# Altium schematic sheet main.SchDoc
size A4
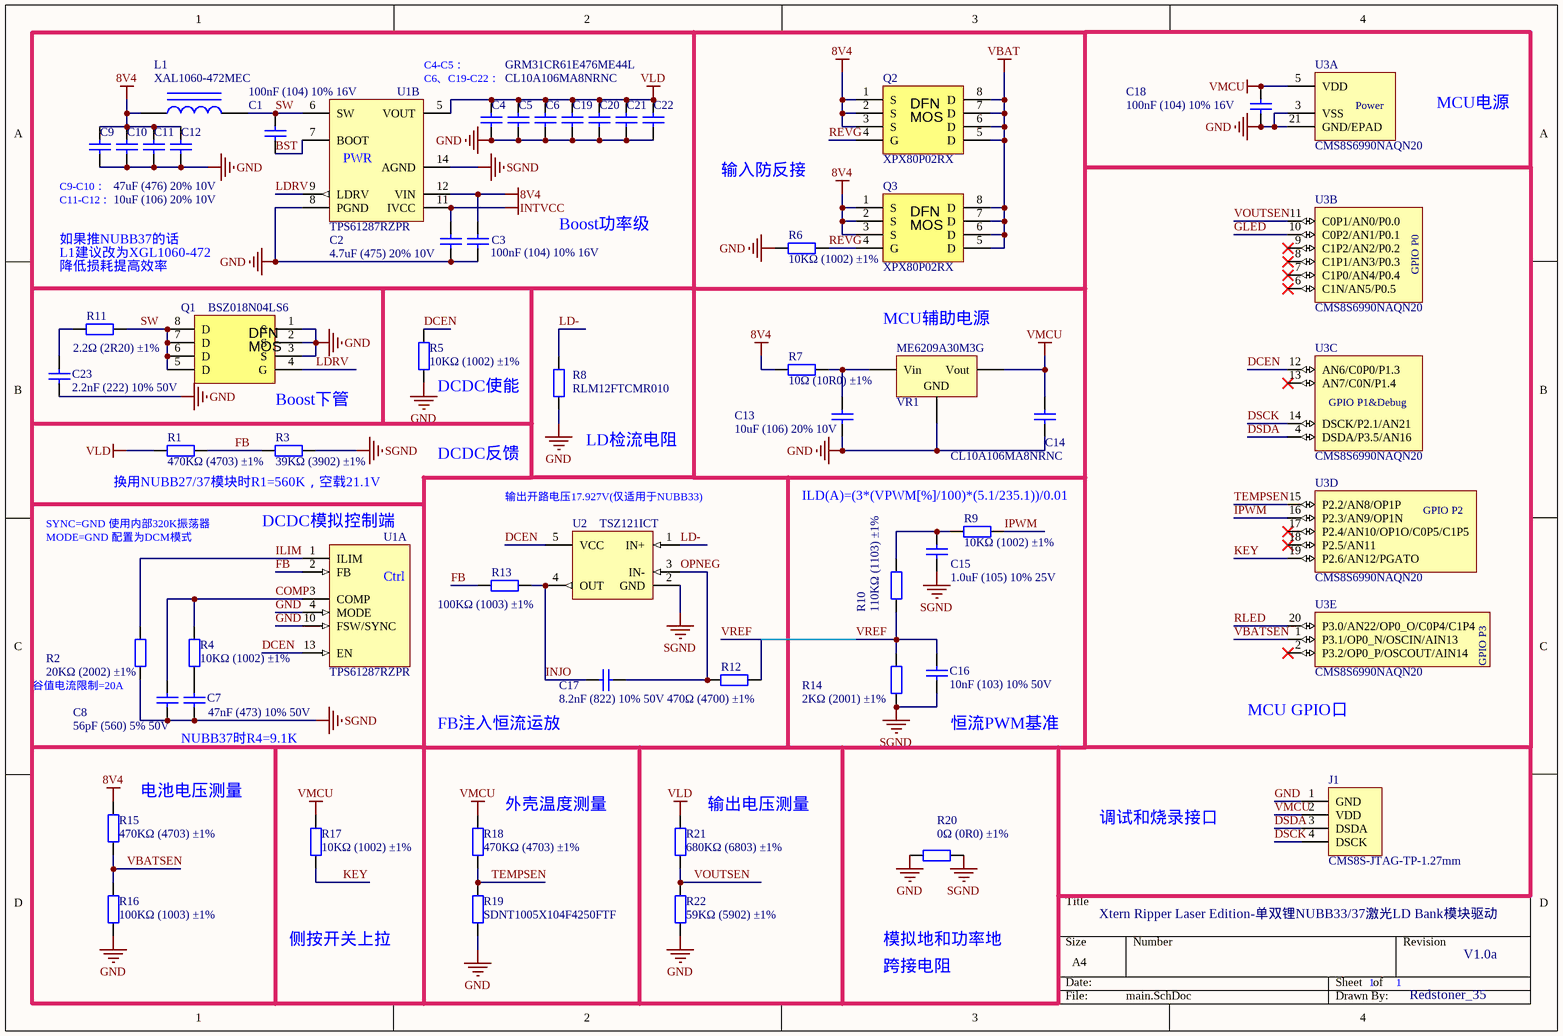
[diagram p0: main.SchDoc]

## Parts
C1  100nF (104) 10% 16V  [0402_C]
C2  4.7uF (475) 20% 10V  [0402_C]
C3  100nF (104) 10% 16V  [0402_C]
C4  GRM31CR61E476ME44L  [1206C]
C5  GRM31CR61E476ME44L  [1206C]  (value not drawn)
C6  CL10A106MA8NRNC  [0603_C]
C7  47nF (473) 10% 50V  [0402_C]
C8  56pF (560) 5% 50V  [0402_C]
C9  10uF (106) 20% 10V  [0402_C]
C10  10uF (106) 20% 10V  [0402_C]  (value not drawn)
C11  47uF (476) 20% 10V  [0805_C]
C12  47uF (226) 20% 10V  [0805_C]  (value not drawn)
C13  10uF (106) 20% 10V  [0402_C]
C14  CL10A106MA8NRNC  [0603_C]
C15  1.0uF (105) 10% 25V  [0402_C]
C16  10nF (103) 10% 50V  [0402_C]
C17  8.2nF (822) 10% 50V  [0402_C]
C18  100nF (104) 10% 16V  [0402_C]
C19  CL10A106MA8NRNC  [0603_C]  (value not drawn)
C20  CL10A106MA8NRNC  [0603_C]  (value not drawn)
C21  CL10A106MA8NRNC  [0603_C]  (value not drawn)
C22  CL10A106MA8NRNC  [0603_C]  (value not drawn)
C23  2.2nF (222) 10% 50V  [0402_C]
J1  CMS8S-JTAG-TP-1.27mm  [CMS8S-JTAG-TP-2x2-P1.27]
L1  XAL1060-472MEC  [XAL1060-472ME-Lifted]
Q1  BSZ018N04LS6  [DFN-8_L3.0-W3.0-P0.65-BL]
Q2  XPX80P02RX  [DFN-8_L3.0-W3.0-P0.65-BL]
Q3  XPX80P02RX  [DFN-8_L3.0-W3.0-P0.65-BL]
R1  470KΩ (4703) ±1%  [0402_R]
R2  20KΩ (2002) ±1%  [0402_R]
R3  39KΩ (3902) ±1%  [0402_R]
R4  10KΩ (1002) ±1%  [0402_R]
R5  10KΩ (1002) ±1%  [0402_R]
R6  10KΩ (1002) ±1%  [0402_R]
R7  10Ω (10R0) ±1%  [0402_R]
R8  RLM12FTCMR010  [1206_R]
R9  10KΩ (1002) ±1%  [0402_R]
R10  110KΩ (1103) ±1%  [0402_R]
R11  2.2Ω (2R20) ±1%  [0603_R]
R12  470Ω (4700) ±1%  [0402_R]
R13  100KΩ (1003) ±1%  [0402_R]
R14  2KΩ (2001) ±1%  [0402_R]
R15  470KΩ (4703) ±1%  [0402_R]
R16  100KΩ (1003) ±1%  [0402_R]
R17  10KΩ (1002) ±1%  [0402_R]
R18  470KΩ (4703) ±1%  [0402_R]
R19  SDNT1005X104F4250FTF  [0402_R]
R20  0Ω (0R0) ±1%  [0402_R]
R21  680KΩ (6803) ±1%  [0402_R]
R22  59KΩ (5902) ±1%  [0402_R]
U1  TPS61287RZPR  [RZP0014A-TPS61287]  (parts A,B of 2)
U2  TSZ121ICT  [SC70-5]
U3  CMS8S6990NAQN20  [QFN40P300X300X800_HS-21N]  (parts A,B,C,D,E of 5)
VR1  ME6209A30M3G  [SOT-23-3L]

## Nets
8V4: C3.2 C9.2 C10.2 C11.2 C12.2 L1.1 Q2.1(S) Q2.2(S) Q2.3(S) Q3.1(S) Q3.2(S) Q3.3(S) R7.1 R15.2 U1.12(VIN)
GND: C2.1 C3.1 C4.1 C5.1 C6.1 C9.1 C10.1 C11.1 C12.1 C13.1 C14.1 C18.1 C19.1 C20.1 C21.1 C22.1 C23.1 J1.1(GND) Q1.1(S) Q1.2(S) Q1.3(S) R5.1 R6.1 R8.1 R16.1 R19.1 R20.1 R22.1 U1.4(MODE) U1.8(PGND) U1.10(FSW/SYNC) U3.3(VSS) U3.21(GND/EPAD) VR1.1(GND)
INTVCC: C2.2 U1.11(IVCC)
SGND: C7.1 C8.1 C15.1 C16.1 R2.2 R3.1 R14.1 R20.2 U1.14(AGND) U2.2(GND)
VBAT: Q2.5(D) Q2.6(D) Q2.7(D) Q2.8(D) Q3.5(D) Q3.6(D) Q3.7(D) Q3.8(D)
VLD: C4.2 C5.2 C6.2 C19.2 C20.2 C21.2 C22.2 R1.1 R21.2 U1.5(VOUT)
VMCU: C14.2 C18.2 J1.2(VDD) R17.2 R18.2 U3.5(VDD) VR1.2(Vout)
BST: C1.1 U1.7(BOOT)
COMP: C8.2 R4.2 U1.3(COMP)
DCEN: R5.2 U1.13(EN) U2.5(VCC) U3.12(AN6/C0P0/P1.3)
DSCK: J1.4(DSCK) U3.14(DSCK/P2.1/AN21)
DSDA: J1.3(DSDA) U3.4(DSDA/P3.5/AN16)
FB: R1.2 R3.2 R13.1 U1.2(FB)
GLED: U3.10(C0P2/AN1/P0.1)
ILIM: R2.1 U1.1(ILIM)
INJO: C17.1 R13.2 U2.4(OUT)
IPWM: R9.1 U3.16(P2.3/AN9/OP1N)
KEY: R17.1 U3.19(P2.6/AN12/PGATO)
LD-: R8.2 U2.1(IN+)
LDRV: Q1.4(G) U1.9(LDRV)
OPNEG: C17.2 R12.1 U2.3(IN-)
REVG: Q2.4(G) Q3.4(G) R6.2
RLED: U3.20(P3.0/AN22/OP0_O/C0P4/C1P4)
SW: C1.2 L1.2 Q1.5(D) Q1.6(D) Q1.7(D) Q1.8(D) R11.2 U1.6(SW)
TEMPSEN: R18.1 R19.2 U3.15(P2.2/AN8/OP1P)
VBATSEN: R15.1 R16.2 U3.1(P3.1/OP0_N/OSCIN/AIN13)
VOUTSEN: R21.1 R22.2 U3.11(C0P1/AN0/P0.0)
VREF: C16.2 R10.1 R12.2 R14.2
NetC7_2: C7.2 R4.1
NetC13_2: C13.2 R7.2 VR1.3(Vin)
NetC15_2: C15.2 R9.2 R10.2
NetC23_2: C23.2 R11.1

Not connected (* = marked no-connect by the designer): U3 2(P3.2/OP0_P/OSCOUT/AIN14)* 6(C1N/AN5/P0.5)* 7(C1P0/AN4/P0.4)* 8(C1P1/AN3/P0.3)* 9(C1P2/AN2/P0.2)* 13(AN7/C0N/P1.4)* 17(P2.4/AN10/OP1O/C0P5/C1P5)* 18(P2.5/AN11)*

## Notes on the sheet
- C4-C5：
- C6、C19-C22：
- MCU电源
- 输入防反接
- C9-C10：
- C11-C12：
- 如果推NUBB37的话
- Boost功率级
- L1建议改为XGL1060-472
- 降低损耗提高效率
- MCU辅助电源
- (near Q1) Boost下管
- (near R5) DCDC使能
- (near R8) LD检流电阻
- 换用NUBB27/37模块时R1=560K，空载21.1V
- DCDC反馈
- (near U2) 输出开路电压17.927V(仅适用于NUBB33)
- ILD(A)=(3*(VPWM[%]/100)*(5.1/235.1))/0.01
- SYNC=GND 使用内部320K振荡器
- MODE=GND 配置为DCM模式
- (near U1) DCDC模拟控制端
- 谷值电流限制=20A
- (near U3) MCU GPIO口
- NUBB37时R4=9.1K
- FB注入恒流运放
- 恒流PWM基准
- (near R15) 电池电压测量
- (near R18) 外壳温度测量
- (near R21) 输出电压测量
- 调试和烧录接口
- Xtern Ripper Laser Edition-单双锂NUBB33/37激光LD Bank模块驱动
- 侧按开关上拉
- 模拟地和功率地
- 跨接电阻
- 1
- V1.0a
- Redstoner_35
- (in symbol CM8S6990NA-QFN20, part A) Power
- (in symbol CM8S6990NA-QFN20, part B) GPIO P0
- (in symbol CM8S6990NA-QFN20, part C) GPIO P1&Debug
- (in symbol CM8S6990NA-QFN20, part D) GPIO P2
- (in symbol CM8S6990NA-QFN20, part E) GPIO P3
- (in symbol SON/DFN5x6 MOS) DFN; MOS
- (in symbol TPS61287, part A) Ctrl
- (in symbol TPS61287, part B) PWR

## Library data of the parts
C1 C3 C7 C18 = 0402 100nF (104) 10% 16V: 贴片电容; ComponentLink1Description: 供应商链接; ComponentLink1URL: http://www.szlcsc.com/product/details_1877.html; Package: 0402; Supplier: LC; SuppliersPartNumber: C1525
C2 = 0402 4.7uF (475) 20% 10V: 贴片电容; ComponentLink1Description: 供应商链接; ComponentLink1URL: http://www.szlcsc.com/product/details_24469.html; Package: 0402; Supplier: LC; SuppliersPartNumber: C23733
C4 C5 = Cap: 村田1206 MLCC 25V 47uF± 20% X5R; Published: 8-Jun-2000; LatestRevisionDate: 17-Jul-2002; LatestRevisionNote: Re-released for DXP Platform.; PackageReference: RAD-0.3; Publisher: Altium Limited; PackageDescription: Radial Cap, Thru-Hole; 2 Leads; 0.3 in Pin Spacing; Value: 47uF
C6 C14 C19-C22 = 0603 10uF (106) 10% 10V: 三星MLCC X5R 10uF ±20% 25V 0603封装; ComponentLink1Description: 供应商链接; ComponentLink1URL: http://www.szlcsc.com/product/details_20411.html; Package: 0603; Supplier: LC; SuppliersPartNumber: C19702
C8 = 0402 56pF (560) 5% 50V: 贴片电容; ComponentLink1Description: 供应商链接; ComponentLink1URL: http://www.szlcsc.com/product/details_1924.html; Package: 0402; Supplier: LC; SuppliersPartNumber: C1572
C9 C10 C13 = 0402 10uF (106) 20% 6.3V: 贴片电容; ComponentLink1Description: 供应商链接; ComponentLink1URL: http://www.szlcsc.com/product/details_16204.html; Package: 0402; Supplier: LC; SuppliersPartNumber: C15525
C11 C12 = 0805 22uF (226) 20% 25V: 贴片电容; ComponentLink1Description: 供应商链接; ComponentLink1URL: http://www.szlcsc.com/product/details_46786.html; Package: 0805; Supplier: LC; SuppliersPartNumber: C45783
C15 = 0402 1.0uF (105) 10% 25V: 贴片电容; ComponentLink1Description: 供应商链接; ComponentLink1URL: http://www.szlcsc.com/product/details_53938.html; Package: 0402; Supplier: LC; SuppliersPartNumber: C52923
C16 C17 = 0402 22nF (223) 10% 50V: 贴片电容; ComponentLink1Description: 供应商链接; ComponentLink1URL: http://www.szlcsc.com/product/details_1884.html; Package: 0402; Supplier: LC; SuppliersPartNumber: C1532
C23 = 0402 2.2nF (222) 10% 50V: 贴片电容; ComponentLink1Description: 供应商链接; ComponentLink1URL: http://www.szlcsc.com/product/details_1883.html; Package: 0402; Supplier: LC; SuppliersPartNumber: C1531
J1 = CMS8S-JTAG-TP-1.27mm: 面向CMS8S6990NA单片机的调试贴片触点，并不是元器件实物
L1 = Inductor Iron: 线艺一体成型模压电感，9.8mΩ DCR 25A饱和电流 4.7uH±20%电感量 10*11*6mm尺寸; Value: 4.7uH; Published: 24-Mar-1999; LatestRevisionDate: 17-Jul-2002; LatestRevisionNote: Re-released for DXP Platform.; PackageReference: AXIAL-0.9; Publisher: Altium Limited; PackageDescription: Axial Device, Thru-Hole; 2 Leads; 0.9 in Pin Spacing
Q1-Q3 = SON/DFN5x6 MOS: PDFN3x3 30V 50A N沟道MOSFET
R1 R15 R18 R21 = 0402 470KΩ (4703) 1%: 贴片电阻; ComponentLink1Description: 供应商链接; ComponentLink1URL: http://www.szlcsc.com/product/details_26533.html; Package: 0402; Supplier: LC; SuppliersPartNumber: C25790
R2 = 0402 20KΩ (2002) 1%: 贴片电阻; ComponentLink1Description: 供应商链接; ComponentLink1URL: http://www.szlcsc.com/product/details_26508.html; Package: 0402; Supplier: LC; SuppliersPartNumber: C25765
R3 = 0402 39KΩ (3902) 1%: 贴片电阻; ComponentLink1Description: 供应商链接; ComponentLink1URL: http://www.szlcsc.com/product/details_26526.html; Package: 0402; Supplier: LC; SuppliersPartNumber: C25783
R4 = 0402 12KΩ (1202) 1%: 贴片电阻; ComponentLink1Description: 供应商链接; ComponentLink1URL: http://www.szlcsc.com/product/details_26495.html; Package: 0402; Supplier: LC; SuppliersPartNumber: C25752
R5 R6 R9 R14 R17 = 0402 10KΩ (1002) 1%: 贴片电阻; ComponentLink1Description: 供应商链接; ComponentLink1URL: http://www.szlcsc.com/product/details_26487.html; Package: 0402; Supplier: LC; SuppliersPartNumber: C25744
R7 = 0402 10Ω (10R0) 1%: 贴片电阻; ComponentLink1Description: 供应商链接; ComponentLink1URL: http://www.szlcsc.com/product/details_25820.html; Package: 0402; Supplier: LC; SuppliersPartNumber: C25077
R8 = 1206 0Ω (0R0) 1%: 10mΩ ±1% 1W 1206封装合金检流电阻; ComponentLink1Description: 供应商链接; ComponentLink1URL: http://www.szlcsc.com/product/details_18576.html; Package: 1206; Supplier: LC; SuppliersPartNumber: C17888
R10 = 0402 75KΩ (7502) 1%: 贴片电阻; ComponentLink1Description: 供应商链接; ComponentLink1URL: http://www.szlcsc.com/product/details_26541.html; Package: 0402; Supplier: LC; SuppliersPartNumber: C25798
R11 = 0603 2.2Ω (2R20) 1%: 贴片电阻; ComponentLink1Description: 供应商链接; ComponentLink1URL: http://www.szlcsc.com/product/details_23666.html; Package: 0603; Supplier: LC; SuppliersPartNumber: C22939
R12 = 0402 470Ω (4700) 1%: 贴片电阻; ComponentLink1Description: 供应商链接; ComponentLink1URL: http://www.szlcsc.com/product/details_25860.html; Package: 0402; Supplier: LC; SuppliersPartNumber: C25117
R13 R16 = 0402 100KΩ (1003) 1%: 贴片电阻; ComponentLink1Description: 供应商链接; ComponentLink1URL: http://www.szlcsc.com/product/details_26484.html; Package: 0402; Supplier: LC; SuppliersPartNumber: C25741
R19 = 0402 200KΩ (2003) 1%: 贴片热敏电阻0402 B4250 100K ±1%; ComponentLink1Description: 供应商链接; ComponentLink1URL: http://www.szlcsc.com/product/details_26507.html; Package: 0402; Supplier: LC; SuppliersPartNumber: C25764
R20 = 0402 0Ω (0R0) 1%: 贴片电阻; ComponentLink1Description: 供应商链接; ComponentLink1URL: http://www.szlcsc.com/product/details_17853.html; Package: 0402; Supplier: LC; SuppliersPartNumber: C17168
R22 = 0402 68KΩ (6802) 1%: 贴片电阻; ComponentLink1Description: 供应商链接; ComponentLink1URL: http://www.szlcsc.com/product/details_37849.html; Package: 0402; Supplier: LC; SuppliersPartNumber: C36871
U1 = TPS61287: Synchronous Boost Converter with Stackable Multi-Phase Function
U2 = LMV321IDCKR: CMOS超小型0漂移斩波结构运算放大器，SC70-5封装，400KHz GBW
U3 = CM8S6990NA-QFN20: 增强型闪存1T 8051单片机，16KB Flash 256+1K XRAM，QFN3x3-20P封装
VR1 = SOT-23 XC6206P332MR: 低压差线性稳压(LDO); ComponentLink1Description: 供应商链接; ComponentLink1URL: http://www.szlcsc.com/product/details_5896.html; Package: SOT-23; Supplier: LC; SuppliersPartNumber: C5446